# EAGLE design BitsyOSD-Eagle (EAGLE 7.3.0)
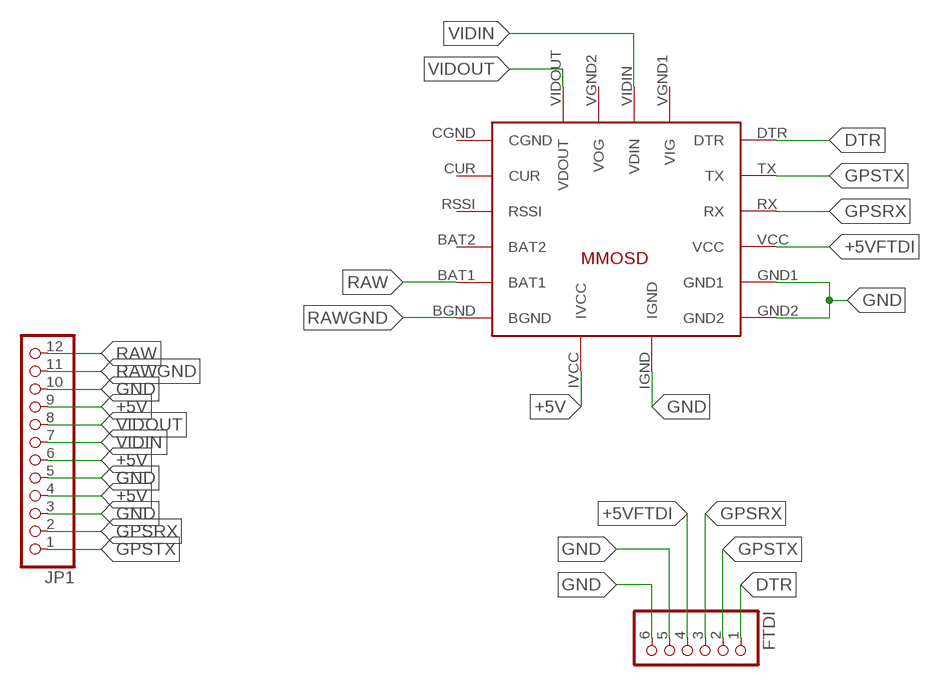
[diagram p0: schematic, sheet 1]

## Parts
FTDI  PINHD-1X6  [1X06]
JP1  PINHD-1X12  [1X12]
U$2  MICROMINIMOSDPWR  [MMOSDNVDVID]

## Nets
+5V: JP1.4 JP1.6 JP1.9 U$2.IVCC
+5VFTDI: FTDI.4 U$2.VCC
DTR: FTDI.1 U$2.DTR
GND: FTDI.5 FTDI.6 JP1.3 JP1.5 JP1.10 U$2.GND1 U$2.GND2 U$2.IGND
GPSRX: FTDI.3 JP1.2 U$2.RX
GPSTX: FTDI.2 JP1.1 U$2.TX
RAW: JP1.12 U$2.BAT1
RAWGND: JP1.11 U$2.BGND
VIDIN: JP1.7 U$2.VIDIN(VDIN)
VIDOUT: JP1.8 U$2.VIDOUT(VDOUT)
Unconnected: U$2.CUR U$2.RSSI U$2.VGND1(VIG) U$2.VGND2(VOG)

## Power pins joined to a net without a drawn wire
BAT2: U$2.BAT2
CGND: U$2.CGND

## Library data of the parts
FTDI = pinhead:PINHD-1X6: PIN HEADER
JP1 = pinhead:PINHD-1X12: PIN HEADER
U$2 = FPVTools:MICROMINIMOSDPWR

## Net classes
0 default: width 0.762 mm, drill 0.508 mm, clearance 0.508 mm

## Board
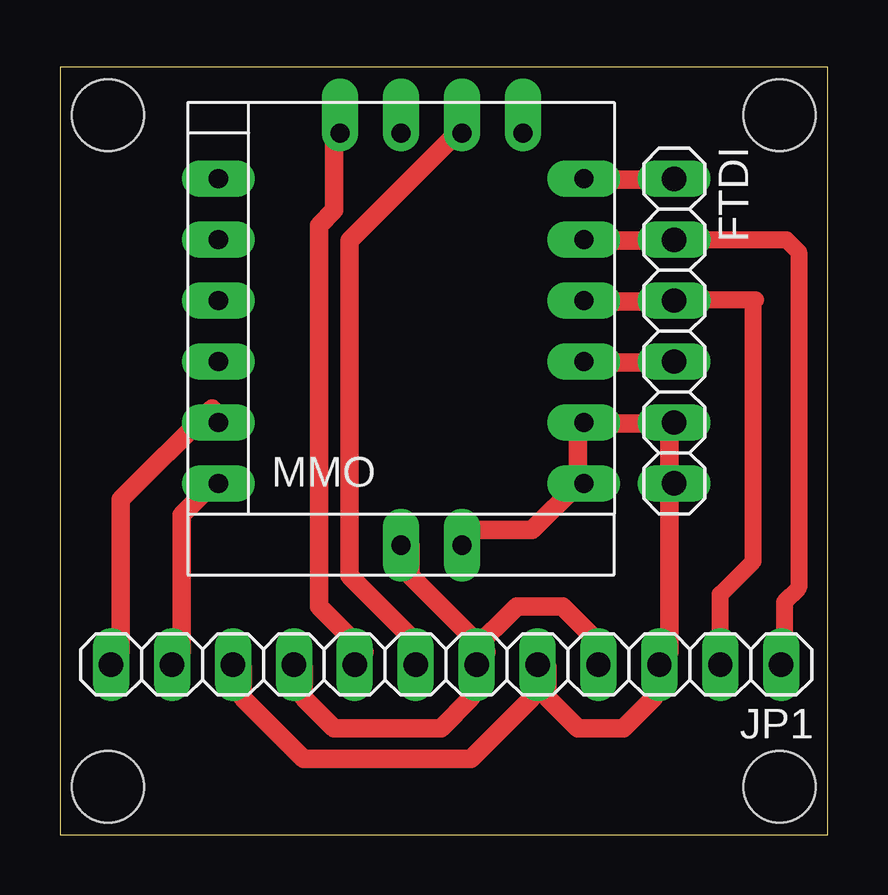
[diagram p1: board, top side]

Size 32 x 32 mm. Coordinates in mm from the lower left corner, seen from the top.
Outline: 0,0 32,0 32,32 0,32 0,0
Copper layers (1*16): Top 0.035mm / dielectric 1.5mm / Bottom 0.035mm
Design rules "default": minimum track width 10mil, minimum drill 24mil, track to track 8mil, track to pad 8mil, pad to pad 8mil, via to via 8mil, smd to smd 8mil, copper to edge 40mil, drill to drill 8mil, minimum pad ring 10mil, minimum via ring 8mil, stop-mask expansion 4mil, vias tented up to drill 0mil, thermal gap 10mil
Holes 3 mm at 30,2 2,2 2,30 30,30

### Footprints (pad centres in the part's own frame; a part is rotated, then mirrored left to right if it is on the bottom)
1X06 = drill 1.016 long: 1 -6.35,0; 2 -3.81,0; 3 -1.27,0; 4 1.27,0; 5 3.81,0; 6 6.35,0
1X12 = drill 1.016 long: 1 -13.97,0; 2 -11.43,0; 3 -8.89,0; 4 -6.35,0; 5 -3.81,0; 6 -1.27,0; 7 1.27,0; 8 3.81,0; 9 6.35,0; 10 8.89,0; 11 11.43,0; 12 13.97,0
MMOSDNVDVID = drill 0.8 pad 1.524 long: BAT1 -7.62,-3.81; BAT2 -7.62,-1.27; BGND -7.62,-6.35; CGND -7.62,3.81; CUR -7.62,6.35; DTR 7.62,6.35; GND1 7.62,-3.81; GND2 7.62,-6.35; IGND 2.54,-8.93; IVCC 0,-8.93; RSSI -7.62,1.27; RX 7.62,1.27; TX 7.62,3.81; VCC 7.62,-1.27 | drill 0.8 pad 1.524 offset: VGND1 0,8.255; VGND2 5.08,8.255; VIDIN 2.54,8.255; VIDOUT -2.54,8.255

### Placement (x,y rotation side)
FTDI  25.61,21 270 top
JP1  16.1,7.1 180 top
U$2  14.22,21 0 top

### Tracks (layer width: path | path; a pad name or v marks a point on that pad's centre or on a via)
+5V
  Top 0.762: JP1.9 10.16,6.99 10.16,5.71 11.43,4.45 15.88,4.45 17.14,5.71 17.14,6.99 JP1.6 | JP1.4 22.23,7.62 22.23,8.26 20.95,9.53 19.05,9.53 17.14,7.62 JP1.6 | U$2.IVCC 14.61,12.06 14.61,10.79 17.78,7.62 JP1.6
+5VFTDI
  Top 0.762: U$2.VCC 22.23,19.68 25.4,19.68 FTDI.4
DTR
  Top 0.762: U$2.DTR 22.23,27.3 25.4,27.3 FTDI.1
GND
  Top 0.762: JP1.10 7.62,6.99 7.62,5.71 10.16,3.17 17.14,3.17 19.68,5.71 19.68,6.99 JP1.5 20.32,6.99 20.32,5.71 21.59,4.45 23.5,4.45 24.77,5.71 24.77,6.99 JP1.3 25.4,7.62 25.4,14.61 FTDI.6 25.4,15.24 25.4,17.14 | U$2.IGND 17.14,12.7 19.68,12.7 21.59,14.61 U$2.GND2 21.59,15.24 21.59,17.14 U$2.GND1 22.23,17.14 25.4,17.14 | 25.4,17.14 FTDI.5
GPSRX
  Top 0.7: JP1.2 27.53,10.03 28.9,11.4 28.9,22.2 29,22.3 25.64,22.3 FTDI.3
  Top 0.762: U$2.RX 22.23,22.23 25.4,22.23 FTDI.3
GPSTX
  Top 0.7: FTDI.2 30.29,24.81 30.8,24.3 30.8,10.3 30.2,9.7 30.2,7.23 JP1.1
  Top 0.762: U$2.TX 22.23,24.77 25.4,24.77 FTDI.2
RAW
  Top 0.762: JP1.12 2.54,7.62 2.54,13.97 6.35,17.78 U$2.BAT1
RAWGND
  Top 0.762: JP1.11 5.08,7.62 5.08,13.34 6.35,14.61 U$2.BGND
VIDIN
  Top 0.762: JP1.7 14.61,7.62 14.61,8.26 12.06,10.79 12.06,24.77 16.51,29.21 U$2.VIDIN
VIDOUT
  Top 0.762: U$2.VIDOUT 11.43,29.21 11.43,26.04 10.79,25.4 10.79,9.53 12.7,7.62 JP1.8